# EAGLE schematic test (EAGLE 8.2.2)

## Sheet 1 of 3
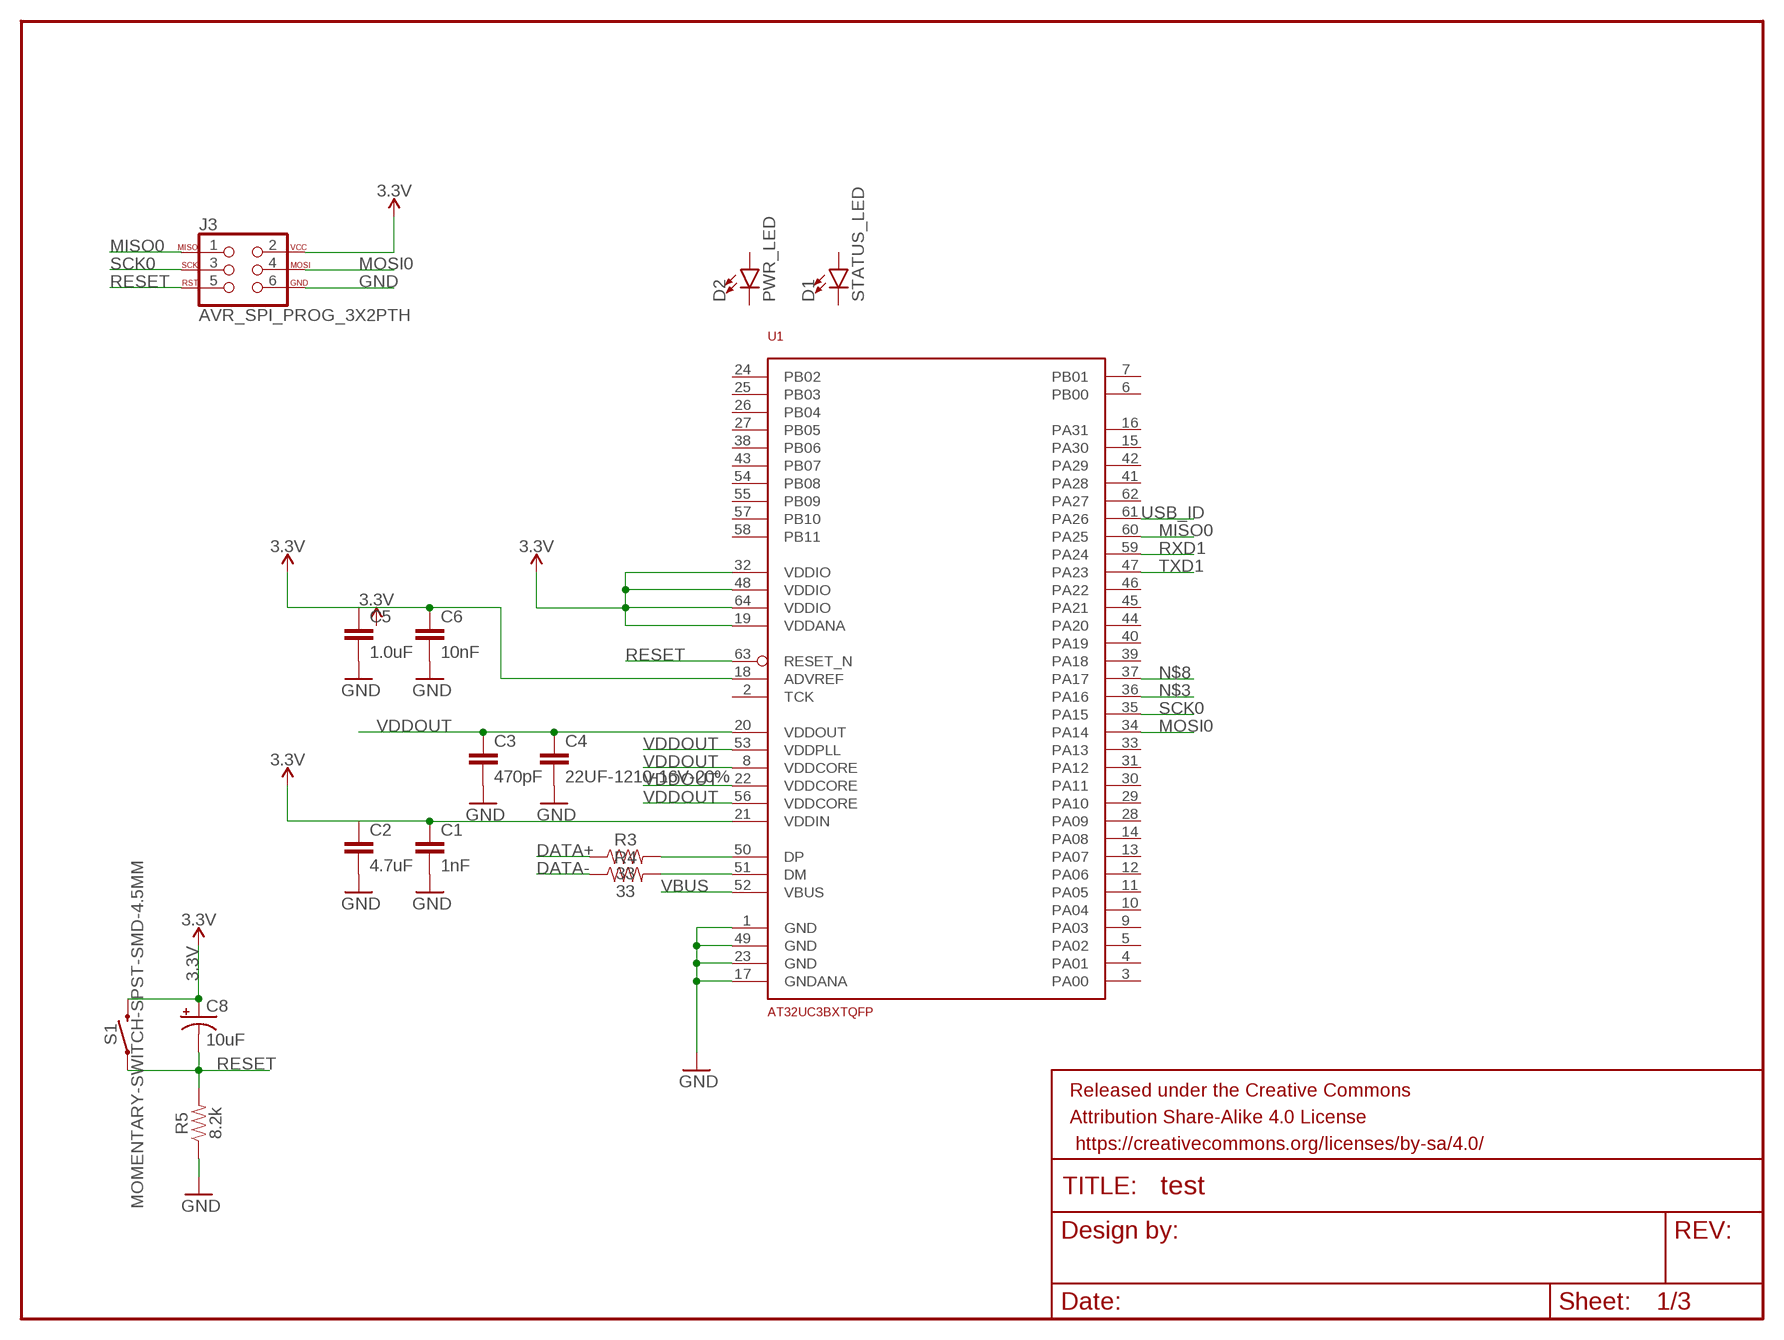
[diagram p0: schematic, sheet 1]

### Parts
C1  1nF  1.0NF/1000PF-0603-50V-10%  [0603]
C2  4.7uF  4.7UF-1206-16V-(+80/-20%)  [1206]
C3  470pF  470PF-0603-50V-5%  [0603]
C4  22UF-1210-16V-20%  [1210]
C5  1.0uF  1.0UF-0603-16V-10%  [0603]
C6  10nF  10NF-0603-50V-10%  [0603]
C8  10uF  10UF-POLAR-0603-6.3V-20%(TANT)  [0603-POLAR]
D1  STATUS_LED  LED0603  [LED-0603]
D2  PWR_LED  LED0603  [LED-0603]
FRAME1  FRAME-LETTER  [CREATIVE_COMMONS]
J3  AVR_SPI_PROG_3X2PTH  [2X3]
R3  33  33OHM-0603-1/10W-1%  [0603]
R4  33  33OHM-0603-1/10W-1%  [0603]
R5  8.2k  8.2KOHM-0603-1/10W-5%  [0603]
S1  MOMENTARY-SWITCH-SPST-SMD-4.5MM  [TACTILE_SWITCH_SMD_4.5MM]
U1  AT32UC3BXTQFP  [TQFP64]

### Nets
3.3V: C1.1 C2.1 C5.1 C6.1 C8.+ J3.2 S1.1 S1.4 U1.18(ADVREF) U1.19(VDDANA) U1.21(VDDIN) U1.32(VDDIO) U1.48(VDDIO) U1.64(VDDIO) ; also sheet 2
DATA+: R3.1 ; also sheet 2
DATA-: R4.1 ; also sheet 2
GND: C1.2 C2.2 C3.2 C4.2 C5.2 C6.2 J3.6 R5.1 U1.1(GND) U1.17(GNDANA) U1.23(GND) U1.49(GND) ; also sheet 2
J$1: R3.2 U1.50(DP)
MISO0: J3.1 U1.60(PA25)
MOSI0: J3.4 U1.34(PA14)
N$3: U1.36(PA16)
N$8: U1.37(PA17)
RESET: C8.- J3.5 R5.2 S1.2 S1.3 U1.63(RESET_N)
RXD1: U1.59(PA24)
SCK0: J3.3 U1.35(PA15)
TXD1: U1.47(PA23)
U$1: R4.2 U1.51(DM)
USB_ID: U1.61(PA26) ; also sheet 2
VBUS: U1.52(VBUS) ; also sheet 2
VDDOUT: C3.1 C4.1 U1.8(VDDCORE) U1.20(VDDOUT) U1.22(VDDCORE) U1.53(VDDPLL) U1.56(VDDCORE)
Unconnected: D1.A D1.C D2.A D2.C U1.2(TCK) U1.3(PA00) U1.4(PA01) U1.5(PA02) U1.6(PB00) U1.7(PB01) U1.9(PA03) U1.10(PA04) U1.11(PA05) U1.12(PA06) U1.13(PA07) U1.14(PA08) U1.15(PA30) U1.16(PA31) U1.24(PB02) U1.25(PB03) U1.26(PB04) U1.27(PB05) U1.28(PA09) U1.29(PA10) U1.30(PA11) U1.31(PA12) U1.33(PA13) U1.38(PB06) U1.39(PA18) U1.40(PA19) U1.41(PA28) U1.42(PA29) U1.43(PB07) U1.44(PA20) U1.45(PA21) U1.46(PA22) U1.54(PB08) U1.55(PB09) U1.57(PB10) U1.58(PB11) U1.62(PA27)

## Sheet 2 of 3
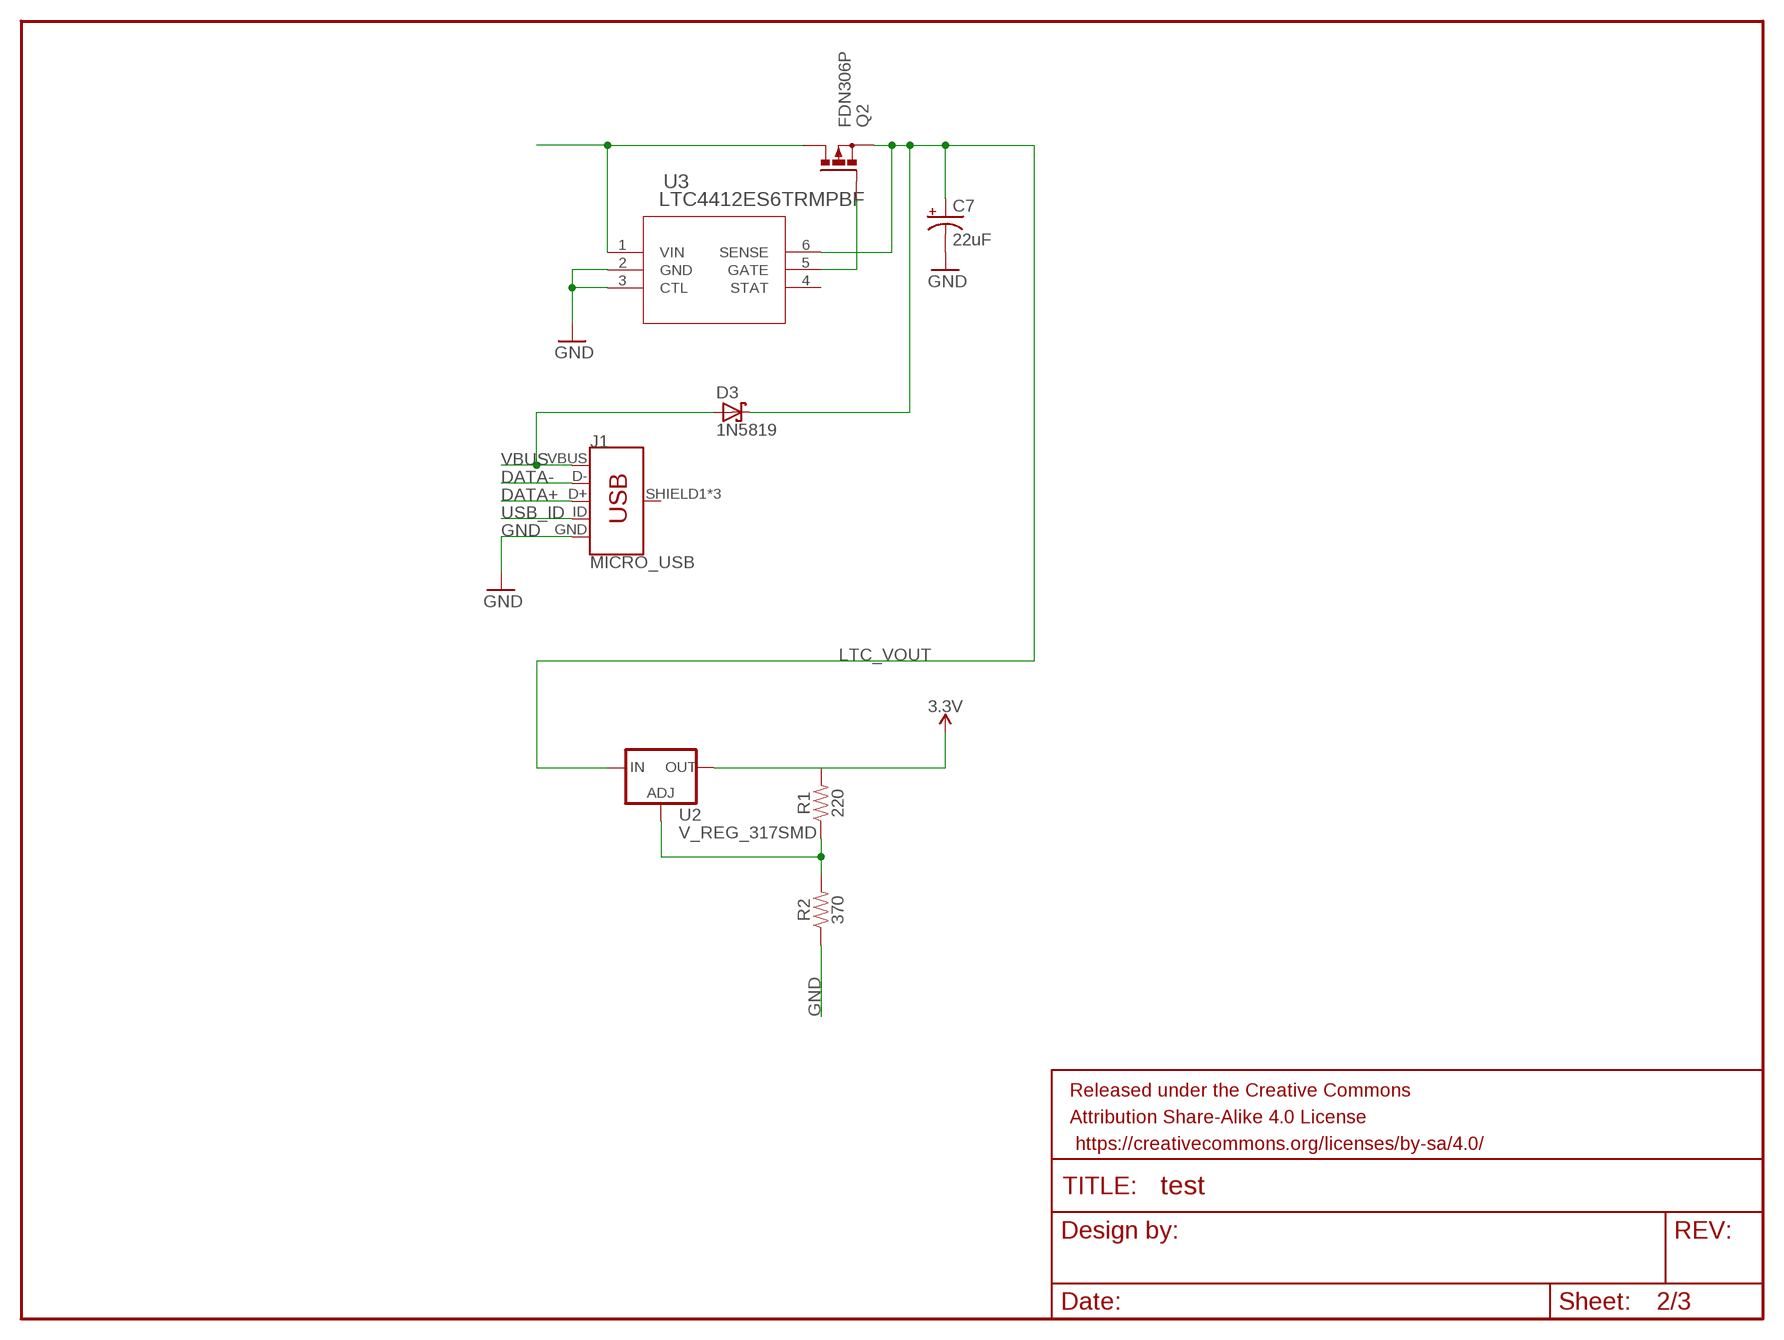
[diagram p1: schematic, sheet 2]

### Parts
C7  22uF  22UF-POLAR-PANASONIC_C-35V-20%  [PANASONIC_C]
D3  1N5819  SCHOTTKY-DIODESMD  [SMB]
FRAME2  FRAME-LETTER  [CREATIVE_COMMONS]
J1  MICRO_USB  USB_MICRO-B_FEMALE-SMT  [USB-B-MICRO-SMD]
Q2  FDN306P  P-MOSFET-SO8  [SO-08]
R1  220  33OHM-0603-1/10W-1%  [0603]
R2  370  1KOHM-0603-1/10W-1%  [0603]
U2  V_REG_317SMD  [SOT223]
U3  LTC4412ES6TRMPBF  [SOT-6_S]

### Nets
3.3V: R1.2 U2.2(OUT) ; also sheet 1
DATA+: J1.D+ ; also sheet 1
DATA-: J1.D- ; also sheet 1
GND: C7.- J1.GND R2.1 U3.2(GND) U3.3(CTL) ; also sheet 1
LTC_VOUT: C7.+ D3.C Q2.1(S) Q2.2(S) Q2.3(S) U2.3(IN) U3.6(SENSE)
N$1: Q2.5(D) Q2.6(D) Q2.7(D) Q2.8(D) U3.1(VIN)
N$4: R1.1 R2.2 U2.1(ADJ)
N$7: Q2.4(G) U3.5(GATE)
USB_ID: J1.ID ; also sheet 1
VBUS: D3.A J1.VBUS ; also sheet 1
Unconnected: J1.SHIELD1(SHIELD) J1.SHIELD2(SHIELD) J1.SHIELD3(SHIELD) U3.4(STAT)

## Sheet 3 of 3
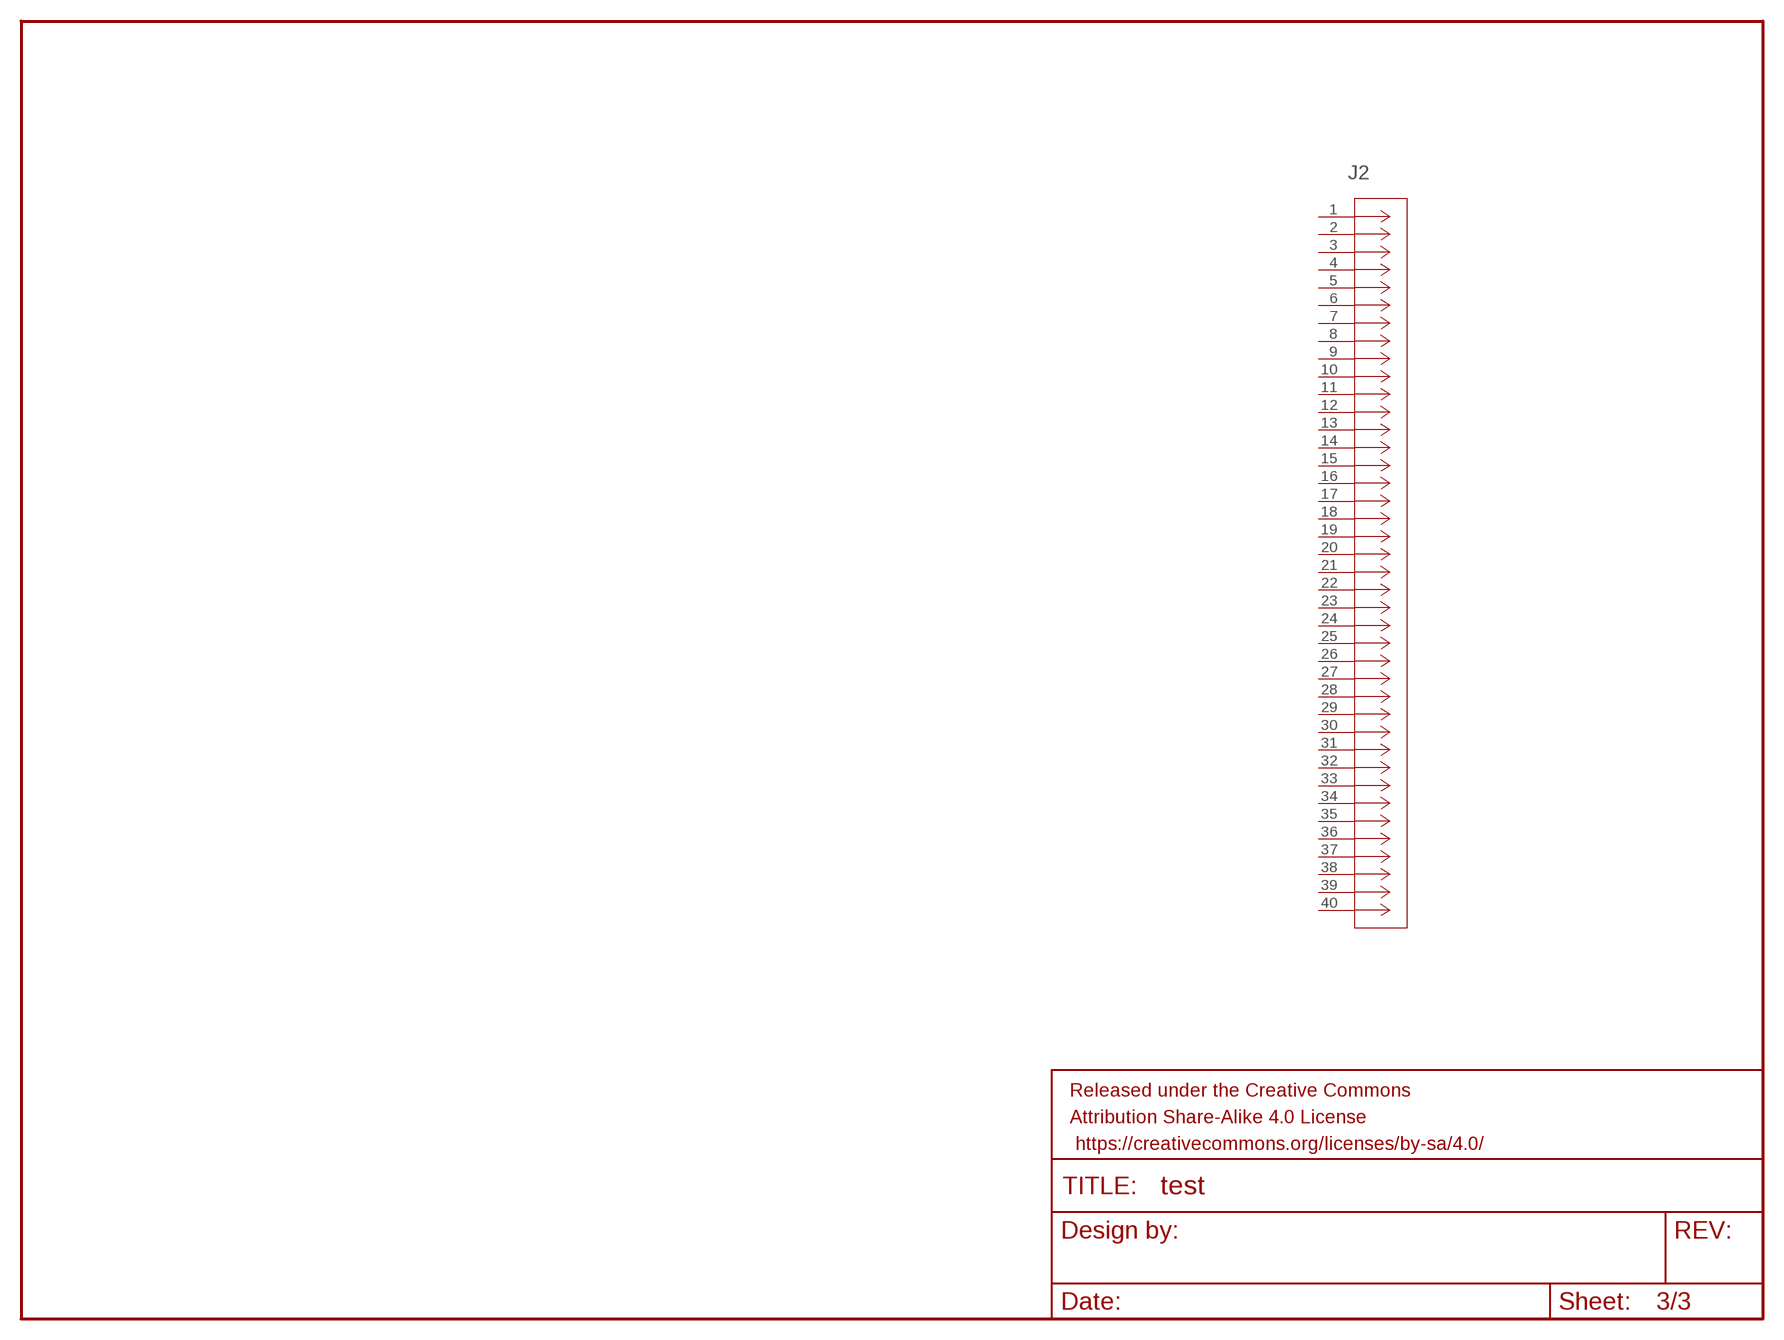
[diagram p2: schematic, sheet 3]

### Parts
FRAME3  FRAME-LETTER  [CREATIVE_COMMONS]
J2  4-1734742-0  [CONN_4-1734742-0_TYCO]
Unconnected: J2.1 J2.2 J2.3 J2.4 J2.5 J2.6 J2.7 J2.8 J2.9 J2.10 J2.11 J2.12 J2.13 J2.14 J2.15 J2.16 J2.17 J2.18 J2.19 J2.20 J2.21 J2.22 J2.23 J2.24 J2.25 J2.26 J2.27 J2.28 J2.29 J2.30 J2.31 J2.32 J2.33 J2.34 J2.35 J2.36 J2.37 J2.38 J2.39 J2.40

## Library data of the parts
C1 = SparkFun-Capacitors:1.0NF/1000PF: 1nF/1,000pF ceramic capacitors A capacitor is a passive two-terminal electrical component used to store electrical energy temporarily in an electric field.; PROD_ID: CAP-07886
C2 = SparkFun-Capacitors:4.7UF: 4.7µF ceramic capacitors A capacitor is a passive two-terminal electrical component used to store electrical energy temporarily in an electric field.; PROD_ID: CAP-10300
C3 = SparkFun-Capacitors:470PF: 470pF ceramic capacitors A capacitor is a passive two-terminal electrical component used to store electrical energy temporarily in an electric field.; PROD_ID: CAP-07884
C4 = SparkFun-Capacitors:22UF: 22µF ceramic capacitors A capacitor is a passive two-terminal electrical component used to store electrical energy temporarily in an electric field.
C5 = SparkFun-Capacitors:1.0UF: 1µF ceramic capacitors A capacitor is a passive two-terminal electrical component used to store electrical energy temporarily in an electric field.; PROD_ID: CAP-00868
C6 = SparkFun-Capacitors:10NF: 0.01uF/10nF/10,000pF ceramic capacitors A capacitor is a passive two-terminal electrical component used to store electrical energy temporarily in an electric field. CAP-09321; PROD_ID: CAP-00867
C7 = SparkFun-Capacitors:22UF-POLAR: 22µF polarized capacitors A capacitor is a passive two-terminal electrical component used to store electrical energy temporarily in an electric field.; PROD_ID: CAP-08618
C8 = SparkFun-Capacitors:10UF-POLAR: 10.0µF polarized capacitors A capacitor is a passive two-terminal electrical component used to store electrical energy temporarily in an electric field.; PROD_ID: CAP-13210
D1 D2 = SparkFun-LED:LED: LED (Generic) Standard schematic elements and footprints for 5mm, 3mm, 1206, and 0603 sized LEDs. Generic LEDs with no color specified.
D3 = diode:SCHOTTKY-DIODE: Schottky Diode
FRAME1-FRAME3 = SparkFun-Aesthetics:FRAME-LETTER: Schematic Frame - Letter Standard 8.5x11 US Letter frame
J1 = SparkFun-Connectors:USB_MICRO-B: USB Type Micro-B Connector Male/female and PTH/SMT variants SparkFun Products: SparkFun microB USB Breakout <https://www.sparkfun.com/products/12035> SparkFun USB microB Plug Breakout <https://www.sparkfun.com/products/10031> SparkFun ESP8266 Thing <https://www.sparkfun.com/products/13231>; PROD_ID: CONN-11752
J2 = MyLibrary:4-1734742-0; MANUFACTURER_PART_NUMBER: 417347420; VENDOR: Tyco Electronics
J3 = SparkFun-Connectors:AVR_SPI_PROG_3X2: AVR ISP 6 Pin This is the reduced ISP connector for AVR programming. Common on Arduino. This footprint will take up less PCB space and can be used with a 10-pin to 6-pin adapter such as SKU: BOB-08508 **Special note about "TEST_POINT" package. The stop mask is on the top side, so if you want your programming test points to be on the bottom of your board, make sure to place this package on the bottom side of the board. This also ensure that the orientation to program from the bottom side will be correct. SparkFun Products: SparkFun ISP Pogo Adapter <https://www.sparkfun.com/products/11591> - NS Tiny AVR Programmer <https://www.sparkfun.com/products/11801> -PTH
Q2 = transistor-power:P-MOSFET-SO8: P-Channel MOSFET Example: FDS4435A; P-Channel Logic Level PowerTrench® MOSFET FDS4465; P-Channel 1.8V Specified PowerTrench® MOSFET Source: www.fairchildsemi.com
R1 = SparkFun-Resistors:33OHM: 33Ω resistor A resistor is a passive two-terminal electrical component that implements electrical resistance as a circuit element. Resistors act to reduce current flow, and, at the same time, act to lower voltage levels within circuits. - Wikipedia; PROD_ID: RES-08270; VALUE: 33
R2 = SparkFun-Resistors:1KOHM: 1kΩ resistor A resistor is a passive two-terminal electrical component that implements electrical resistance as a circuit element. Resistors act to reduce current flow, and, at the same time, act to lower voltage levels within circuits. - Wikipedia; PROD_ID: RES-07856; VALUE: 1k
R3 R4 = SparkFun-Resistors:33OHM: 33Ω resistor A resistor is a passive two-terminal electrical component that implements electrical resistance as a circuit element. Resistors act to reduce current flow, and, at the same time, act to lower voltage levels within circuits. - Wikipedia; PROD_ID: RES-08270
R5 = SparkFun-Resistors:8.2KOHM: 8.2kΩ resistor A resistor is a passive two-terminal electrical component that implements electrical resistance as a circuit element. Resistors act to reduce current flow, and, at the same time, act to lower voltage levels within circuits. - Wikipedia; PROD_ID: RES-10646
S1 = SparkFun-Switches:MOMENTARY-SWITCH-SPST: Momentary Switch (Pushbutton) - SPST Normally-open (NO) SPST momentary switches (buttons, pushbuttons). Variants PTH-12MM - 12mm square, through-hole Momentary Pushbutton Switch - 12mm Square <https://www.sparkfun.com/products/9190> (COM-09190) PTH-6.0MM, PTH-6.0MM-KIT - 6.0mm square, through-hole Mini Pushbutton Switch <https://www.sparkfun.com/products/97> (COM-00097) KIT package intended for soldering kit's - only one side of pads' copper is exposed. PTH-RIGHT-ANGLE-KIT - Right-angle, through-hole Right Angle Tactile Button <https://www.sparkfun.com/products/10791> - Used on SparkFun BigTime Watch Kit <https://www.sparkfun.com/products/11734> SMD-12MM - 12mm square, surface-mount Tactile Button - SMD (12mm) <https://www.sparkfun.com/products/12993> (COM-12993) Used on SparkFun PicoBoard <https://www.sparkfun.com/products/11888> SMD-4.5MM - 4.5mm Square Trackball Switch Used on SparkFun Blackberry Trackballer Breakout <https://www.sparkfun.com/products/13169> SMD-4.6MMX2.8MM - 4.60mm x 2.80mm, surface mount Used on SparkFun SAMD21 Mini Breakout <https://www.sparkfun.com/products/13664> SMD-5.2MM, SMD-5.2-REDUNDANT - 5.2mm square, surface-mount Mini Pushbutton Switch - SMD <https://www.sparkfun.com/products/8720> (COM-08720) Used on Arduino Pro Mini <https://www.sparkfun.com/products/11114> REDUNDANT package connects both switch circuits together SMD-6.0X3.5MM - 6.0 x 3.5mm, surface mount Momentary Reset Switch SMD <https://www.sparkfun.com/products/8229> (COM-08229) SMD-6.2MM-TALL - 6.2mm square, surface mount Tactile Button - SMD (6mm) <https://www.sparkfun.com/products/12992> Used on SparkFun Digital Sandbox <https://www.sparkfun.com/products/12651> SMD-RIGHT-ANGLE - Right-angle, surface mount Used on SparkFun Block for Intel® Edison - Arduino <https://www.sparkfun.com/products/13036>; PROD_ID: SWCH-09213
U1 = SparkFun-IC-Microcontroller:AT32UC3BX
U2 = SparkFun-IC-Power:V_REG_317: Voltage Regulator Standard LM317 adjustable voltage regulator. AOI (Adjust Output Input). Google 'LM317 Calculator' for easy to use app to get the two resistor values needed. 240/720 for 5V output. 240/390 for 3.3V output. Spark Fun Electronics SKU : COM-00527
U3 = MyLibrary:LTC4412ES6TRMPBF; MANUFACTURER_PART_NUMBER: LTC4412ES6#TRMPBF; VENDOR: Linear Technology